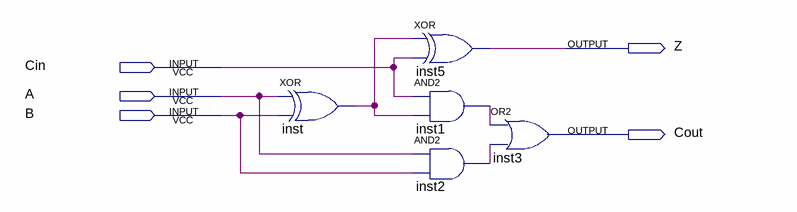
[diagram p0: schematic sheet]
// Quartus schematic FullAdder.bdf as structural Verilog: 5 symbols, 5 pins
module FullAdder (
  input  Cin,
  input  A,
  input  B,
  output Z,
  output Cout
);

  wire inst1_out, inst2_out, inst_out;

  xor inst (inst_out, A, B);
  xor inst5 (Z, inst_out, Cin);
  and inst1 (inst1_out, Cin, inst_out);
  and inst2 (inst2_out, A, B);
  or inst3 (Cout, inst1_out, inst2_out);
endmodule
